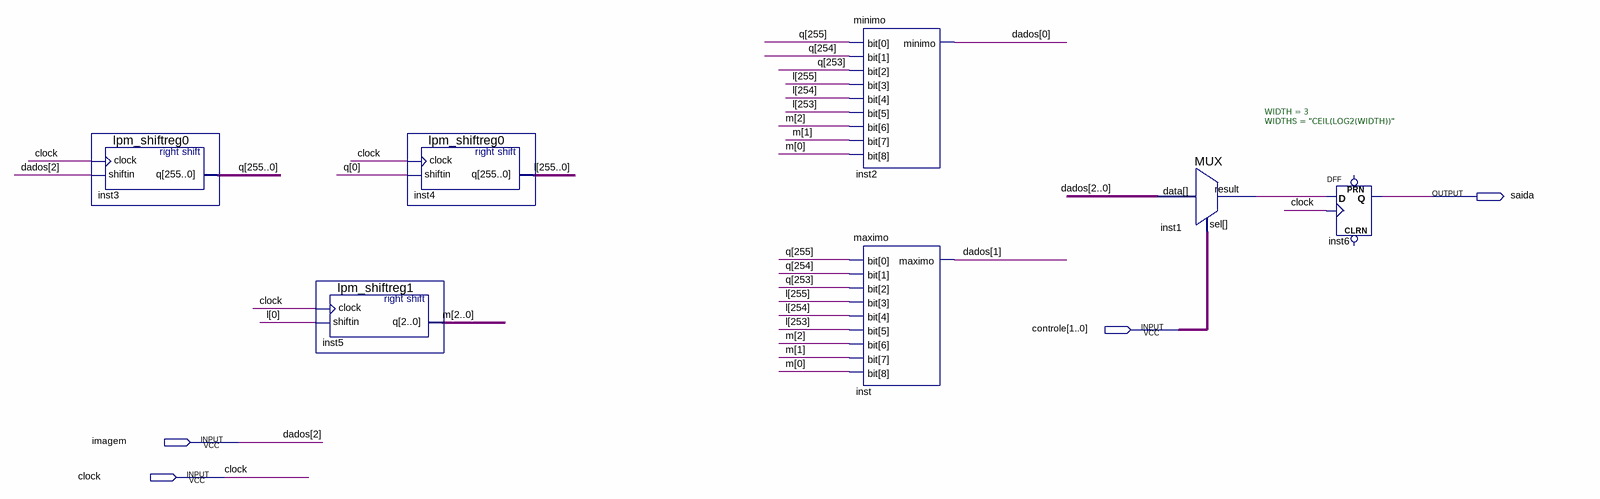
[diagram p0: schematic sheet]
// Quartus schematic praticafiltro.bdf as structural Verilog: 7 symbols, 4 pins
module praticafiltro (
  input  [1:0] controle,
  input  imagem,
  input  clock,
  output saida
);

  wire inst1_result;
  wire [1:0] dados;
  wire [2:0] m;
  wire [255:0] l, q;

  lpm_shiftreg0 inst3 (.clock(clock), .shiftin(imagem), .q(q));
  lpm_shiftreg1 inst5 (.clock(clock), .shiftin(l[0]), .q(m));
  lpm_shiftreg0 inst4 (.clock(clock), .shiftin(q[0]), .q(l));
  minimo inst2 (.\bit ({m[0], m[1], m[2], l[253], l[254], l[255], q[253], q[254], q[255]}), .minimo(dados[0]));
  maximo inst (.\bit ({m[0], m[1], m[2], l[253], l[254], l[255], q[253], q[254], q[255]}), .maximo(dados[1]));
  MUX #(.WIDTH(3), .WIDTHS("CEIL(LOG2(WIDTH))")) inst1 (.data({imagem, dados}), .sel(controle), .result(inst1_result));
  DFF inst6 (.CLK(clock), .D(inst1_result), .Q(saida));  // open: CLRN, PRN

  // Other names for the same wires on the sheet: dados[2] = imagem
endmodule
